# Altium schematic sheet EMMC CHIP.SchDoc: EMMC KLMAG1JETD-B041
size A4; DrawnBy: ThanhQuoc; Revision: V01; SheetNumber: 10; SheetTotal: 21; Project: RV1126 CAMERA BOARD DESIGN
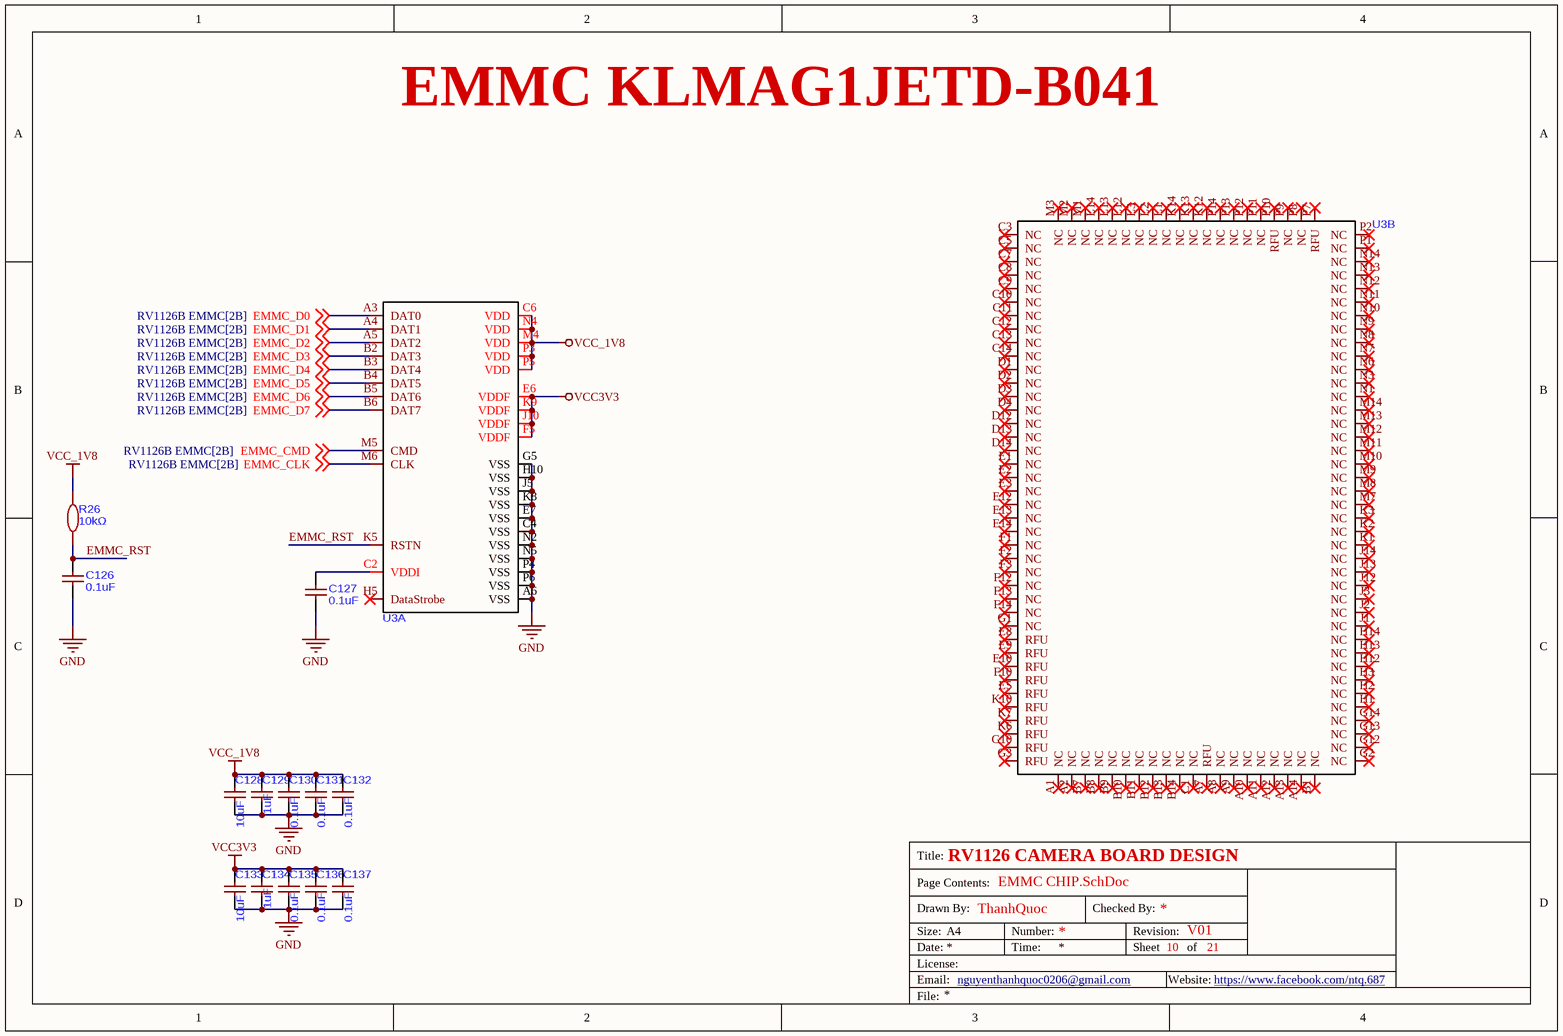
[diagram p0: EMMC CHIP.SchDoc]

## Parts
C126  0.1uF  [C0201]
C127  0.1uF  [C0201]
C128  10uF  [C0402]
C129  1uF  [C0201]
C130  0.1uF  [C0201]
C131  0.1uF  [C0201]
C132  0.1uF  [C0201]
C133  10uF  [C0402]
C134  1uF  [C0201]
C135  0.1uF  [C0201]
C136  0.1uF  [C0201]
C137  0.1uF  [C0201]
R26  10kΩ  [R0201]
U3  emmc 16gb  [FBGA-153_L13.0-W11.5-P0.50_KLMAG1JETD-B041]  (value not drawn)  (parts A,B of 2)

## Nets
GND: C126.1 C127.1 C128.1 C129.1 C130.1 C131.1 C132.1 C133.1 C134.1 C135.1 C136.1 C137.1 U3.A6(VSS) U3.C4(VSS) U3.E7(VSS) U3.G5(VSS) U3.H10(VSS) U3.J5(VSS) U3.K8(VSS) U3.N2(VSS) U3.N5(VSS) U3.P4(VSS) U3.P6(VSS)
VCC3V3: C133.2 C134.2 C135.2 C136.2 C137.2 U3.E6(VDDF) U3.F5(VDDF) U3.J10(VDDF) U3.K9(VDDF)
VCC_1V8: C128.2 C129.2 C130.2 C131.2 C132.2 R26.2 U3.C6(VDD) U3.M4(VDD) U3.N4(VDD) U3.P3(VDD) U3.P5(VDD)
EMMC_CLK: U3.M6(CLK) ; off-sheet EMMC_CLK
EMMC_CMD: U3.M5(CMD) ; off-sheet EMMC_CMD
EMMC_D0: U3.A3(DAT0) ; off-sheet EMMC_D0
EMMC_D1: U3.A4(DAT1) ; off-sheet EMMC_D1
EMMC_D2: U3.A5(DAT2) ; off-sheet EMMC_D2
EMMC_D3: U3.B2(DAT3) ; off-sheet EMMC_D3
EMMC_D4: U3.B3(DAT4) ; off-sheet EMMC_D4
EMMC_D5: U3.B4(DAT5) ; off-sheet EMMC_D5
EMMC_D6: U3.B5(DAT6) ; off-sheet EMMC_D6
EMMC_D7: U3.B6(DAT7) ; off-sheet EMMC_D7
EMMC_RST: C126.2 R26.1 U3.K5(RSTN)
NetC127_2: C127.2 U3.C2(VDDI)

Not connected (* = marked no-connect by the designer): U3 A1(NC)* A2(NC)* A7(RFU)* A8(NC)* A9(NC)* A10(NC)* A11(NC)* A12(NC)* A13(NC)* A14(NC)* B1(NC)* B7(NC)* B8(NC)* B9(NC)* B10(NC)* B11(NC)* B12(NC)* B13(NC)* B14(NC)* C1(NC)* C3(NC)* C5(NC)* C7(NC)* C8(NC)* C9(NC)* C10(NC)* C11(NC)* C12(NC)* C13(NC)* C14(NC)* D1(NC)* D2(NC)* D3(NC)* D4(NC)* D12(NC)* D13(NC)* D14(NC)* E1(NC)* E2(NC)* E3(NC)* E5(RFU)* E8(RFU)* E9(RFU)* E10(RFU)* E12(NC)* E13(NC)* E14(NC)* F1(NC)* F2(NC)* F3(NC)* F10(RFU)* F12(NC)* F13(NC)* F14(NC)* G1(NC)* G2(NC)* G3(RFU)* G10(RFU)* G12(NC)* G13(NC)* G14(NC)* H1(NC)* H2(NC)* H3(NC)* H5(DataStrobe)* H12(NC)* H13(NC)* H14(NC)* J1(NC)* J2(NC)* J3(NC)* J12(NC)* J13(NC)* J14(NC)* K1(NC)* K2(NC)* K3(NC)* K6(RFU)* K7(RFU)* K10(RFU)* K12(NC)* K13(NC)* K14(NC)* L1(NC)* L2(NC)* L3(NC)* L12(NC)* L13(NC)* L14(NC)* M1(NC)* M2(NC)* M3(NC)* M7(NC)* M8(NC)* M9(NC)* M10(NC)* M11(NC)* M12(NC)* M13(NC)* M14(NC)* N1(NC)* N3(NC)* N6(NC)* N7(NC)* N8(NC)* N9(NC)* N10(NC)* N11(NC)* N12(NC)* N13(NC)* N14(NC)* P1(NC)* P2(NC)* P7(RFU)* P8(NC)* P9(NC)* P10(RFU)* P11(NC)* P12(NC)* P13(NC)* P14(NC)*

## Notes on the sheet
- Title:
- Drawn By:
- Page Contents:
- Checked By:
- Size:
- Date:
- File:
- License:
- Email:
- A4
- nguyenthanhquoc0206@gmail.com
- Number:
- Time:
- Revision:
- Sheet
- Website:
- of
- https://www.facebook.com/ntq.687

## Library data of the parts
C126 C127 C130-C132 C135-C137 = CAP_100nF-6.3V-10%-0201_1: 0.1uF ±10% 6.3V Ceramic Capacitor X5R 0201
C128 C133 = CAP_10uF-10V-20%-0402: 10µF ±20% 10V Ceramic Capacitor X5R 0402 (1005 Metric)
C129 C134 = CAP_1uF-6.3V-10%-0201: 1uF ±10% 6.3V Ceramic Capacitor X5R 0201
R26 = RES_10K-50mW-1%-0201: RES 10KΩ ±1% 50mW 0201; ComponentLink1Description: LCSC; ComponentLink1URL: https://www.lcsc.com/product-detail/C93949.html?spm=wm.fly.bg.0.xh&lcsc_vid=EwRWBFZSQVIPVFdUTlJfVldeFFRYUFQAElRYBFRRE1MxVlNeRVlXUFNQQ1RWXjsOAxUeFF5JWBYZEEoKFBINSQcJGk4eFQsCAgIaSgADAwAHC0slRlVYUFFIHxUDCw%3D%3D
U3 = KLMAG1JETD-B041: eMMC 5.1 Specification compatibility